# EAGLE design v1.0_r1 (EAGLE 9.6.2)
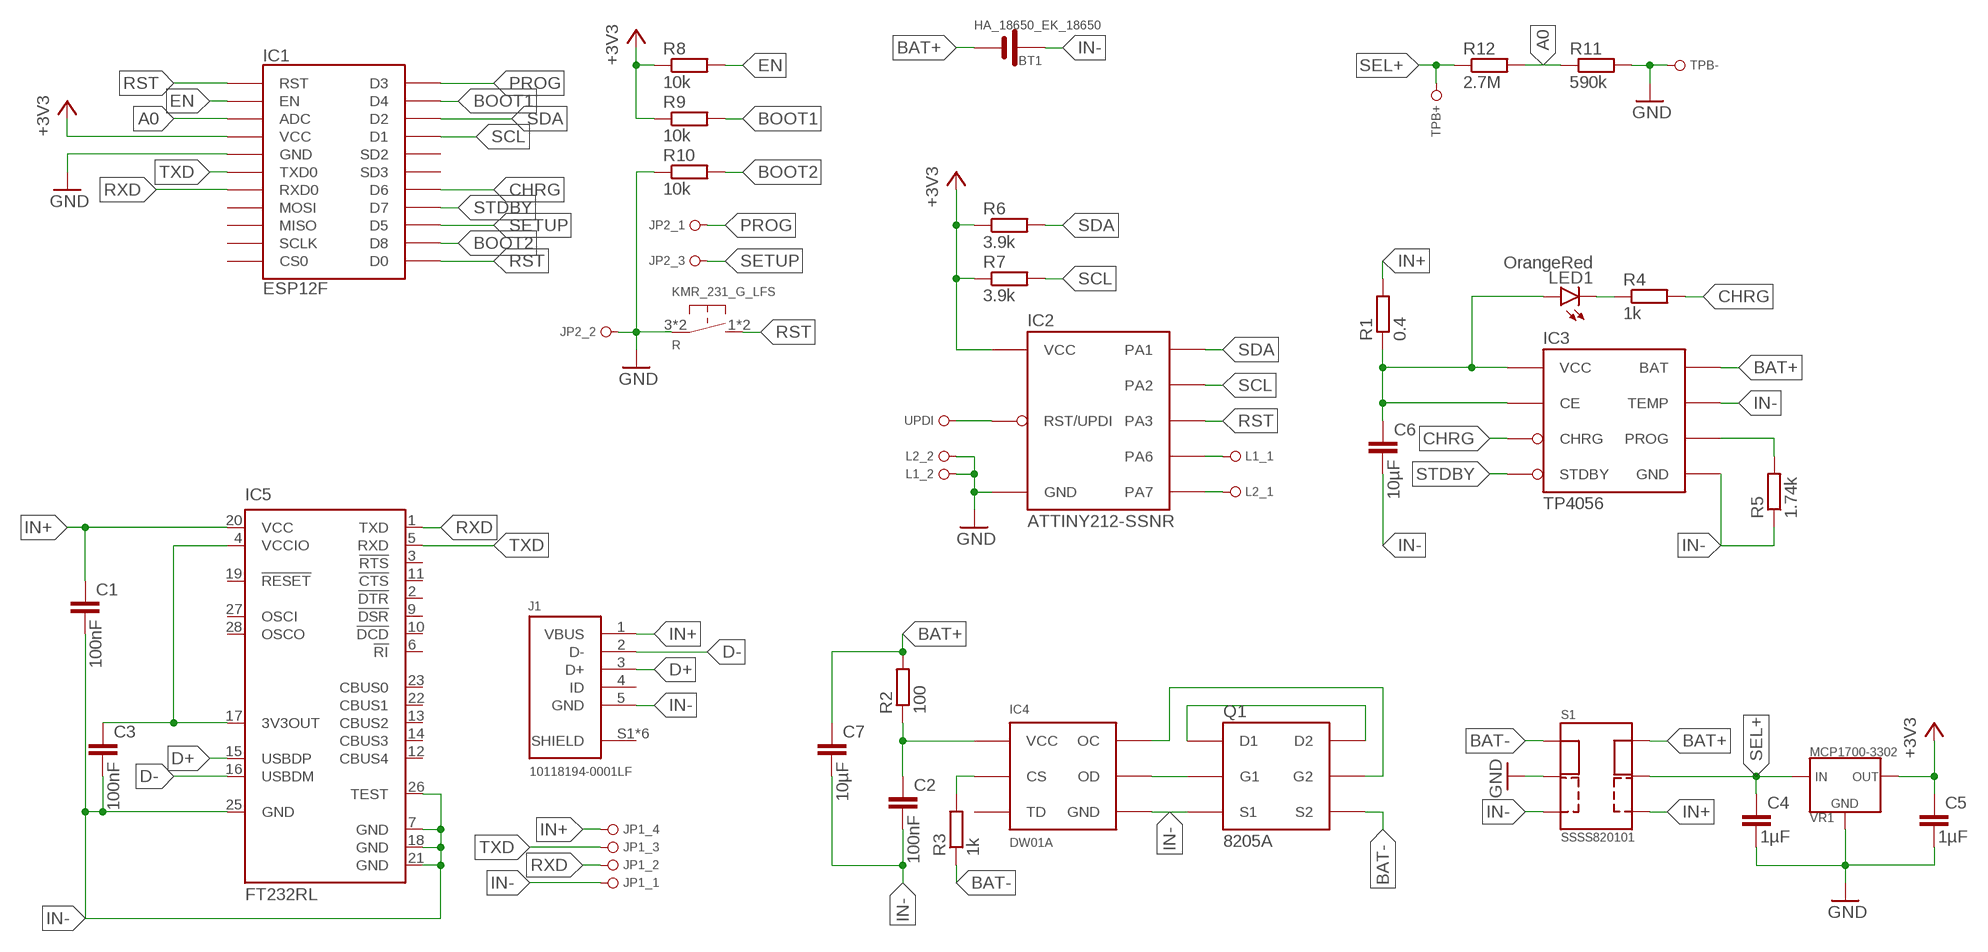
[diagram p0: schematic, sheet 1]

## Parts
BT1  HA_18650_EK_18650  [HA_18650_EK_18650]
C1  100nF  C-EUC0805  [C0805]
C2  100nF  C-EUC0805  [C0805]
C3  100nF  C-EUC0805  [C0805]
C4  1µF  C-EUC0805  [C0805]
C5  1µF  C-EUC0805  [C0805]
C6  10µF  C-EUC0805  [C0805]
C7  10µF  C-EUC0805  [C0805]
IC1  ESP12F  [ESP12]
IC2  ATTINY212-SSNR  [SOIC8]
IC3  TP4056  [SO8-THERMALPAD]
IC4  DW01A  [SOT23-6]
IC5  FT232RL  [SSOP28]
J1  10118194-0001LF  [10118194-0001LF]
JP1  PINHD_1X04_R_1  [1X04_R_1]
JP2  PINHD_1X03_R_1  [1X03_R_1]
L1  PINHD_1X02_R_1  [1X02_R_1]
L2  PINHD_1X02_R_1  [1X02_R_1]
LED1  OrangeRed  LEDCHIP-LED0805  [CHIP-LED0805]
Q1  8205A  [TSSOP8]
R  KMR_231_G_LFS  [KMR_231_G_LFS]
R1  0.4  R-EU_R0805  [R0805]
R2  100  R-EU_R0805  [R0805]
R3  1k  R-EU_R0805  [R0805]
R4  1k  R-EU_R0805  [R0805]
R5  1.74k  R-EU_R0805  [R0805]
R6  3.9k  R-EU_R0805  [R0805]
R7  3.9k  R-EU_R0805  [R0805]
R8  10k  R-EU_R0805  [R0805]
R9  10k  R-EU_R0805  [R0805]
R10  10k  R-EU_R0805  [R0805]
R11  590k  R-EU_R0805  [R0805]
R12  2.7M  R-EU_R0805  [R0805]
S1  SSSS820101  [SSSS820101]
TPB+  PINHD_1X01_S_0.8  [1X01_S_0.8]
TPB-  PINHD_1X01_S_0.8  [1X01_S_0.8]
UPDI  PINHD_1X01_S_0.8  [1X01_S_0.8]
VR1  MCP1700-3302  [SOT23]

## Nets
+3V3: C5.1 IC1.VCC IC2.1(VCC) R6.1 R7.1 R8.1 R9.1 VR1.2(OUT)
A0: IC1.ADC R11.1 R12.2
BAT+: BT1.P1(PLUS) BT1.P2(PLUS) BT1.P3(PLUS) C7.1 IC3.5(BAT) R2.2 S1.6
BAT-: Q1.6(S2) Q1.7(S2) R3.1 S1.3
BOOT1: IC1.GPIO2(D4) R9.2
BOOT2: IC1.GPIO15(D8) R10.2
CHRG: IC1.GPIO12(D6) IC3.7(CHRG) R4.2
D+: IC5.15(USBDP) J1.3(D+)
D-: IC5.16(USBDM) J1.2(D-)
EN: IC1.EN R8.2
GND: C4.2 C5.2 IC1.GND IC2.8(GND) JP2.2 L1.2 L2.2 R10.1 R11.2 R.3 R.4 S1.2 TPB-.1 VR1.1(GND)
IN+: C1.1 IC5.20(VCC) J1.1(VBUS) JP1.4 R1.2 S1.4
IN-: BT1.M1(MINUS) BT1.M2(MINUS) BT1.M3(MINUS) C1.2 C2.2 C3.2 C6.2 C7.2 IC3.1(TEMP) IC3.3(GND) IC3.T1(GND) IC3.T2(GND) IC3.T3(GND) IC3.T4(GND) IC3.T5(GND) IC3.T6(GND) IC3.T7(GND) IC3.T8(GND) IC4.6(GND) IC5.7(GND) IC5.18(GND) IC5.21(GND) IC5.25(GND) IC5.26(TEST) J1.5(GND) JP1.1 Q1.2(S1) Q1.3(S1) R5.1 S1.1
L1: IC2.2(PA6) L1.1
L2: IC2.3(PA7) L2.1
N$1: C6.1 IC3.4(VCC) IC3.8(CE) LED1.A R1.1
N$2: IC3.2(PROG) R5.2
N$3: IC4.2(CS) R3.2
N$4: C2.1 IC4.5(VCC) R2.1
N$7: LED1.C R4.1
N$8: IC4.1(OD) Q1.4(G1)
N$10: Q1.1(D1) Q1.8(D2)
N$11: IC4.3(OC) Q1.5(G2)
PROG: IC1.GPIO0(D3) JP2.1
RST: IC1.GPIO16(D0) IC1.RST IC2.7(PA3) R.1 R.2
RXD: IC1.RXD0 IC5.1(TXD) JP1.2
SCL: IC1.GPIO5(D1) IC2.5(PA2) R7.2
SDA: IC1.GPIO4(D2) IC2.4(PA1) R6.2
SEL+: C4.1 R12.1 S1.5 TPB+.1 VR1.3(IN)
SETUP: IC1.GPIO14(D5) JP2.3
STDBY: IC1.GPIO13(D7) IC3.6(STDBY)
TXD: IC1.TXD0 IC5.5(RXD) JP1.3
UPDI: IC2.6(RST/UPDI) UPDI.1
VCCIO: C3.1 IC5.4(VCCIO) IC5.17(3V3OUT)
Unconnected: IC1.CS0 IC1.GPIO9(SD2) IC1.GPIO10(SD3) IC1.MISO IC1.MOSI IC1.SCLK IC4.4(TD) IC5.2(!DTR) IC5.3(!RTS) IC5.6(!RI) IC5.9(!DSR) IC5.10(!DCD) IC5.11(!CTS) IC5.12(CBUS4) IC5.13(CBUS2) IC5.14(CBUS3) IC5.19(!RESET) IC5.22(CBUS1) IC5.23(CBUS0) IC5.27(OSCI) IC5.28(OSCO) J1.4(ID)

## Power pins joined to a net without a drawn wire
SHIELD: J1.S1(SHIELD) J1.S2(SHIELD) J1.S3(SHIELD) J1.S4(SHIELD) J1.S5(SHIELD) J1.S6(SHIELD)

## Library data of the parts
BT1 = no_reichelt:HA_18650_EK
C1-C7 = rcl:C-EU: CAPACITOR, European symbol; SPICEPREFIX: C
IC1 = no_expressif:ESP12
IC2 = no_microchip:ATTINY212
IC3 = no_reichelt:TP4056
IC4 = no_reichelt:DW01A
IC5 = ftdichip:FT232R: Source: http://www.ftdichip.com/Documents/DataSheets/DS_FT232R_v104.pdf; MPN: FT232RL; OC_FARNELL: 1146032; OC_NEWARK: 91K9918
J1 = no_reichelt:10118194-0001LF: CONN RCPT USB2.0 MICRO B SMD R/A Manufacturer's datasheet <https://www.amphenol-icc.com/media/wysiwyg/files/drawing/10118194.pdf?__cf_chl_jschl_tk__=1e9b4569481076e99900b246ea640525553a7b60-1588047333-0-AZhEk6D50lwOf6CdaXmV1teudqMKHMxqtb1pEtnUtu77sOc-OVRjbCmHdORomVnr0W49D2E8XkcMdJ2SdWt5rDDYIblyJz7fSv-zilM8vQKAQDC1Z9aMVORhnMgYjPDuz8XpfDLul_eaqqFpemo1xIgoZv50WTuLMwu26ci7e02s9PWvR3z1cDqm9GMGYIPwIUd9yh5-TtN_o6DbEkadC7zoJlhYZSw-VEaYzfWnBSFg_n44fbEB3slHLR2YKLSiTmh8RSwpxKUP4gER0KeVoie9w-Ibtx3oKQbsZjrsPLGSu9BzV2nf3QeoErALCQuycvY9WhQdebLIpxaon6SXufpVIIdoKZHRpjuVVlAkUIr9oSIZGQzzOWY1-dWY48jVEOvnvoxw9-xup5uFcr7XWo0>; CREATED_BY: PCBLayout.com; DIGIKEY_PARTNO: 609-4618-2-ND; MANUFACTURER: Amphenol ICC (FCI); MPN: 10118194-0001LF
JP1 = no_pinhd:PINHD_1X04; DRILL: 1mm; PADSHAPE: round
JP2 = no_pinhd:PINHD_1X03; DRILL: 1mm; PADSHAPE: round
L1 L2 = no_pinhd:PINHD_1X02; DRILL: 1mm; PADSHAPE: round
LED1 = led:LED: LED OSRAM: - CHIPLED LG R971, LG N971, LY N971, LG Q971, LY Q971, LO R971, LY R971 LH N974, LH R974 LS Q976, LO Q976, LY Q976 LO Q996 - Hyper CHIPLED LW Q18S LB Q993, LB Q99A, LB R99A - SideLED LS A670, LO A670, LY A670, LG A670, LP A670 LB A673, LV A673, LT A673, LW A673 LH A674 LY A675 LS A676, LA A676, LO A676, LY A676, LW A676 LS A679, LY A679, LG A679 - Hyper Micro SIDELED® LS Y876, LA Y876, LO Y876, LY Y876 LT Y87S - SmartLED LW L88C, LW L88S LB L89C, LB L89S, LG L890 LS L89K, LO L89K, LY L89K LS L896, LA L896, LO L896, LY L896 - TOPLED LS T670, LO T670, LY T670, LG T670, LP T670 LSG T670, LSP T670, LSY T670, LOP T670, LYG T670 LG T671, LOG T671, LSG T671 LB T673, LV T673, LT T673, LW T673 LH T674 LS T676, LA T676, LO T676, LY T676, LB T676, LH T676, LSB T676, LW T676 LB T67C, LV T67C, LT T67C, LS T67K, LO T67K, LY T67K, LW E67C LS E67B, LA E67B, LO E67B, LY E67B, LB E67C, LV E67C, LT E67C LW T67C LS T679, LY T679, LG T679 LS T770, LO T770, LY T770, LG T770, LP T770 LB T773, LV T773, LT T773, LW T773 LH T774 LS E675, LA E675, LY E675, LS T675 LS T776, LA T776, LO T776, LY T776, LB T776 LHGB T686 LT T68C, LB T68C - Hyper Mini TOPLED® LB M676 - Mini TOPLED Santana® LG M470 LS M47K, LO M47K, LY M47K Source: http://www.osram.convergy.de LUXEON: - LUMILED® LXK2-PW12-R00, LXK2-PW12-S00, LXK2-PW14-U00, LXK2-PW14-V00 LXK2-PM12-R00, LXK2-PM12-S00, LXK2-PM14-U00 LXK2-PE12-Q00, LXK2-PE12-R00, LXK2-PE12-S00, LXK2-PE14-T00, LXK2-PE14-U00 LXK2-PB12-K00, LXK2-PB12-L00, LXK2-PB12-M00, LXK2-PB14-N00, LXK2-PB14-P00, LXK2-PB14-Q00 LXK2-PR12-L00, LXK2-PR12-M00, LXK2-PR14-Q00, LXK2-PR14-R00 LXK2-PD12-Q00, LXK2-PD12-R00, LXK2-PD12-S00 LXK2-PH12-R00, LXK2-PH12-S00 LXK2-PL12-P00, LXK2-PL12-Q00, LXK2-PL12-R00 Source: www.luxeon.com KINGBRIGHT: KA-3528ASYC Source: www.kingbright.com
Q1 = no_reichelt:8205A
R = no_reichelt:KMR_231_G_LFS
R1-R12 = rcl:R-EU_: RESISTOR, European symbol; SPICEPREFIX: R
S1 = no_reichelt:SSSS820101
TPB+ TPB- UPDI = no_pinhd:PINHD_1X01; DRILL: 0.8mm; PADSHAPE: square
VR1 = no_reichelt:MCP170

## Board
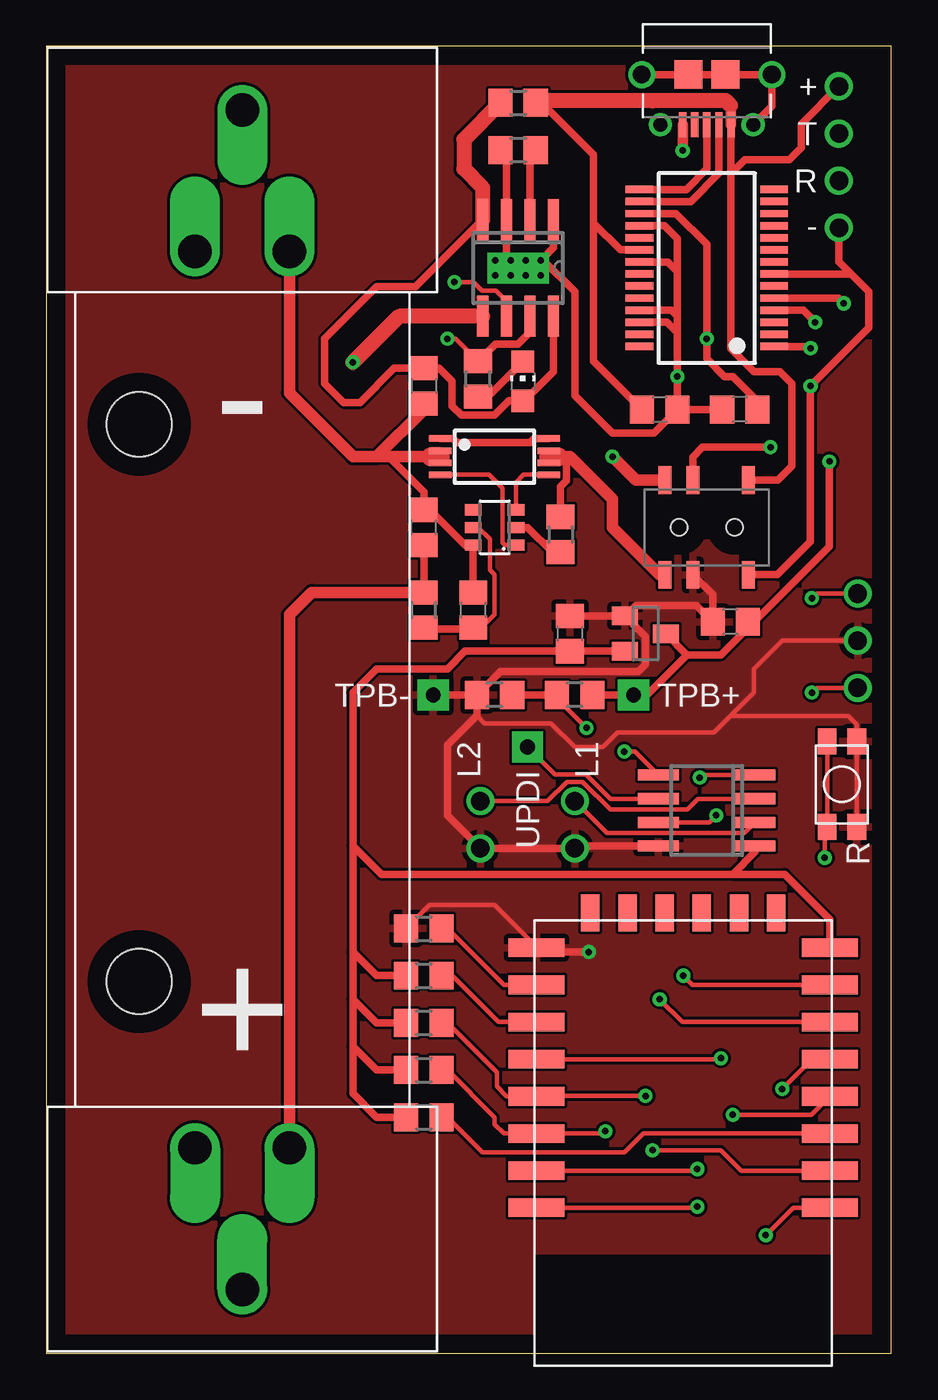
[diagram p1: board, top side]
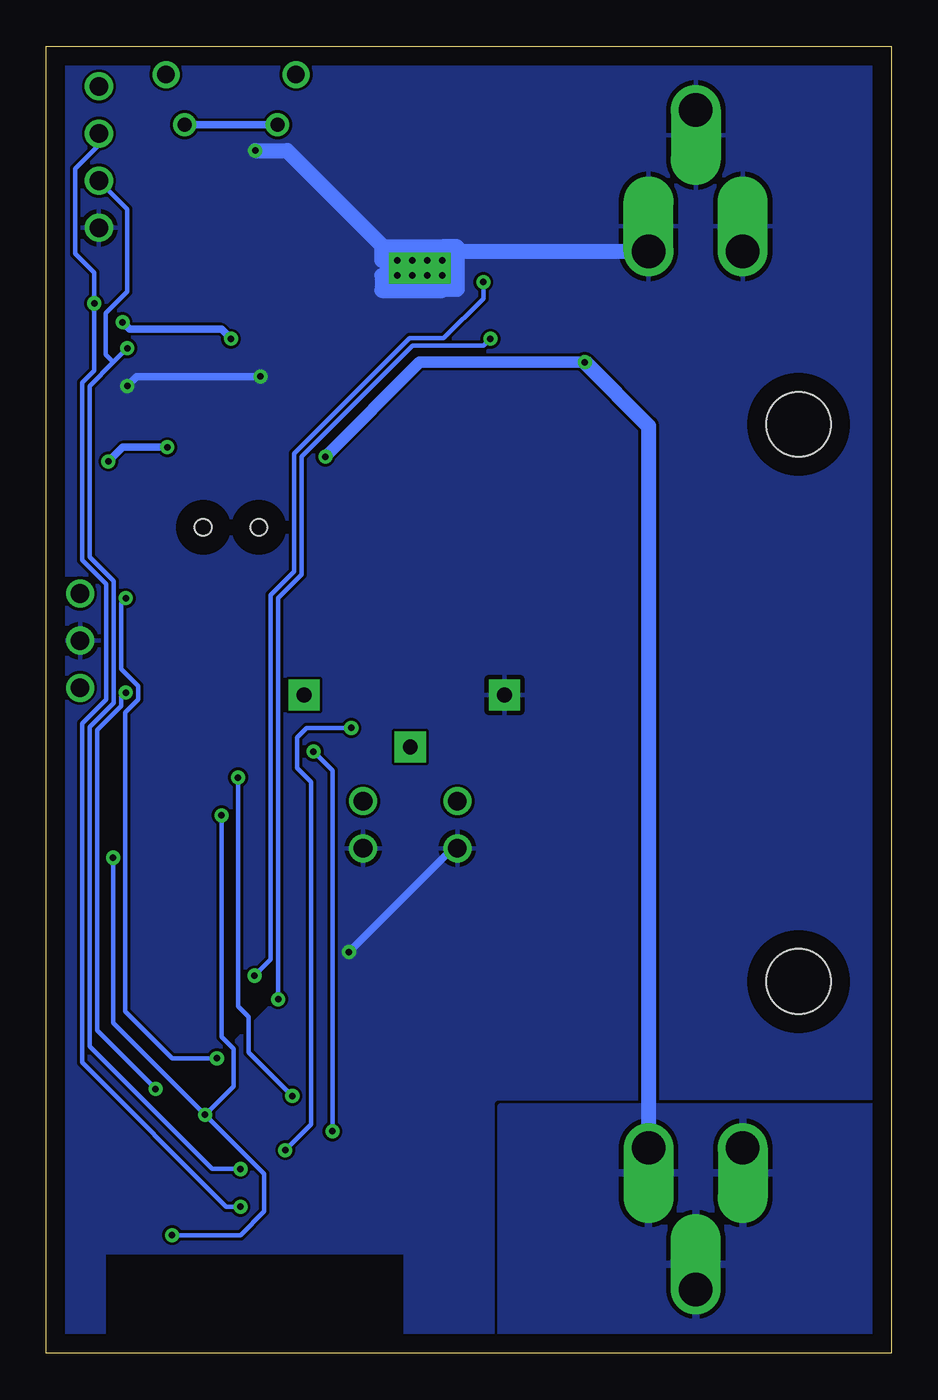
[diagram p2: board, bottom side, seen from below]

Size 45.5 x 70.35 mm. Coordinates in mm from the lower left corner, seen from the top.
Outline: 0,0 45.5,0 45.5,70.35 0,70.35 0,0
Copper layers (1*16): Top 0.035mm / dielectric 1.5mm / Bottom 0.035mm
Design rules "JLCPCB": minimum track width 6mil, minimum drill 0.3mm, track to track 6mil, track to pad 6mil, pad to pad 6mil, via to via 6mil, smd to smd 6mil, copper to edge 40mil, drill to drill 8mil, minimum pad ring 10mil, minimum via ring 8mil, stop-mask expansion 4mil, vias tented up to drill 0mil, thermal gap 10mil
Holes 3.5 mm at 5,20 5,50

### Footprints (pad centres in the part's own frame; a part is rotated, then mirrored left to right if it is on the bottom)
HA_18650_EK_18650 = drill 1.8 offset: M1 0,-30.48; M2 2.54,-22.86; M3 -2.54,-22.86; P1 0,33.02; P2 -2.54,25.4; P3 2.54,25.4
C0805 = smd 1.3 x 1.5: 1 -0.95,0; 2 0.95,0
ESP12 = smd 3 x 1: ADC -7.9,1.48; EN -7.9,-0.52; GND 7.9,-10.52; GPIO0 7.9,-4.52; GPIO2 7.9,-6.52; GPIO4 7.9,-2.52; GPIO5 7.9,-0.52; GPIO12 -7.9,-6.52; GPIO13 -7.9,-8.52; GPIO14 -7.9,-4.52; GPIO15 7.9,-8.52; GPIO16 -7.9,-2.52; RST -7.9,3.48; RXD0 7.9,1.48; TXD0 7.9,3.48; VCC -7.9,-10.52 | smd 1 x 2: CS0 -5,-12.4; GPIO9 -1,-12.4; GPIO10 1,-12.4; MISO -3,-12.4; MOSI 3,-12.4; SCLK 5,-12.4
SOIC8 = smd 0.6 x 2.2: 1 -1.905,-2.6; 2 -0.635,-2.6; 3 0.635,-2.6; 4 1.905,-2.6; 5 1.905,2.6; 6 0.635,2.6; 7 -0.635,2.6; 8 -1.905,2.6
SO8-THERMALPAD = smd 0.6 x 2.2: 1 -1.905,-2.6; 2 -0.635,-2.6; 3 0.635,-2.6; 4 1.905,-2.6; 5 1.905,2.6; 6 0.635,2.6; 7 -0.635,2.6; 8 -1.905,2.6 | drill 0.35 pad 0.813 square: T1 -1.219,0.406; T2 -0.406,0.406; T3 0.406,0.406; T4 1.219,0.406; T5 -1.219,-0.406; T6 -0.406,-0.406; T7 0.406,-0.406; T8 1.219,-0.406
SOT23-6 = smd 0.6 x 0.9: 1 -0.95,-1.15; 2 0,-1.15; 3 0.95,-1.15; 4 0.95,1.15; 5 0,1.15; 6 -0.95,1.15
SSOP28 = smd 0.4 x 1.5: 1 -4.225,-3.625; 2 -3.575,-3.625; 3 -2.925,-3.625; 4 -2.275,-3.625; 5 -1.625,-3.625; 6 -0.975,-3.625; 7 -0.325,-3.625; 8 0.325,-3.625; 9 0.975,-3.625; 10 1.625,-3.625; 11 2.275,-3.625; 12 2.925,-3.625; 13 3.575,-3.625; 14 4.225,-3.625; 15 4.225,3.625; 16 3.575,3.625; 17 2.925,3.625; 18 2.275,3.625; 19 1.625,3.625; 20 0.975,3.625; 21 0.325,3.625; 22 -0.325,3.625; 23 -0.975,3.625; 24 -1.625,3.625; 25 -2.275,3.625; 26 -2.925,3.625; 27 -3.575,3.625; 28 -4.225,3.625
10118194-0001LF = smd 0.4 x 1.35: 1 -1.3,2.7; 2 -0.65,2.7; 3 0,2.7; 4 0.65,2.7; 5 1.3,2.7 | drill 0.75: S1 -2.5,2.7; S2 2.5,2.7 | drill 0.95: S3 -3.5,0; S6 3.5,0 | smd 1.5 x 1.55: S4 -1,0; S5 1,0
1X04_R_1 = drill 1: 1 0,0; 2 2.54,0; 3 5.08,0; 4 7.62,0
1X03_R_1 = drill 1: 1 0,0; 2 2.54,0; 3 5.08,0
1X02_R_1 = drill 1: 1 0,0; 2 2.54,0
CHIP-LED0805 = smd 1.2 x 1.2: A 0,-1.05; C 0,1.05
TSSOP8 = smd 1.2 x 0.35: 1 -2.925,0.975; 2 -2.925,0.325; 3 -2.925,-0.325; 4 -2.925,-0.975; 5 2.925,-0.975; 6 2.925,-0.325; 7 2.925,0.325; 8 2.925,0.975
KMR_231_G_LFS = smd 1 x 1.4: 1 0,4.35; 2 0,-0.25; 3 1.6,-0.25; 4 1.6,4.35
R0805 = smd 1.3 x 1.5: 1 -0.95,0; 2 0.95,0
SSSS820101 = smd 1.5 x 0.7: 1 -2.55,-2.25; 2 -2.55,0.75; 3 -2.55,2.25; 4 2.55,-2.25; 5 2.55,0.75; 6 2.55,2.25 | hole 0.9: 0,1.5; 0,-1.5
1X01_S_0.8 = drill 0.8 pad 1.676 square: 1 0,0
SOT23 = smd 1 x 1.4: 1 -0.95,-1.1; 2 0.95,-1.1; 3 0,1.1

### Placement (x,y rotation side)
BT1  10.54,36.45 180 top
C1  33.02,50.8 0 top
C2  22.99,40.01 90 top
C3  37.34,50.8 180 top
C4  36.83,39.37 180 top
C5  28.19,38.73 90 top
C6  20.32,52.07 270 top
C7  20.32,44.45 90 top
IC1  34.29,11.3 180 top
IC2  35.56,29.21 90 top
IC3  25.4,58.42 180 top
IC4  24.13,44.45 90 top
IC5  35.56,58.42 90 top
J1  35.56,68.83 180 top
JP1  42.67,60.58 90 top
JP2  43.69,40.89 270 top
L1  28.45,29.72 270 top
L2  23.37,29.72 270 top
LED1  25.65,52.32 0 top
Q1  24.13,48.26 0 top
R  42.04,28.57 0 top
R1  25.4,67.31 0 top
R2  20.32,40.01 90 top
R3  27.69,44.07 270 top
R4  23.24,52.45 90 top
R5  25.4,64.77 0 top
R6  20.32,17.78 0 top
R7  20.32,15.24 0 top
R8  20.32,12.7 0 top
R9  20.32,20.32 0 top
R10  20.32,22.86 0 top
R11  24.13,35.43 180 top
R12  28.45,35.43 180 top
S1  35.56,44.45 90 top
TPB+  31.62,35.43 0 top
TPB-  20.83,35.43 0 top
UPDI  25.91,32.64 0 top
VR1  32.26,38.73 270 top

### Tracks (layer width: path | path; a pad name or v marks a point on that pad's centre or on a via)
+3V3
  Top 0.406: VR1.2 C5.1 22.55,37.78 21.59,36.83 17.78,36.83 16.51,35.56 16.51,27.3 | IC2.1 38.16,26.98 36.96,25.78 | 36.96,25.78 18.03,25.78 16.51,27.3 | 36.96,25.78 39.75,25.78 42.19,23.34 IC1.VCC | R8.1 17.78,12.7 16.51,13.97 16.51,16.51 | 16.51,27.3 16.51,21.59 | 16.51,21.59 16.51,19.05 | 16.51,19.05 16.51,16.51 | R7.1 17.78,15.24 16.51,16.51 | R6.1 17.78,17.78 16.51,19.05 | R9.1 17.78,20.32 16.51,21.59
A0  (via drill 0.35)
  Top 0.254: IC1.ADC 37.42,9.82 36.32,10.92 v32.64,10.92 | v29.08,33.66 27.5,35.24 R12.2
  Top 0.406: R11.1 R12.2
  Bottom 0.254: v32.64,10.92 31.24,12.32 31.24,30.73 32,31.5 32,33.15 31.5,33.66 v29.08,33.66
BAT+  (via drill 0.35)
  Top 0.406: C7.1 R2.2
  Top 0.61: BT1.P2 13.08,39.75 14.29,40.95 R2.2 | v30.48,48.26 31.74,47 S1.6
  Top 0.813: IC3.5 18.99,55.82 v16.51,53.34
  Bottom 0.61: v16.51,53.34 25.4,53.34 v30.48,48.26
  Bottom 0.813: v16.51,53.34 13.08,49.91 BT1.P2
  pour Bottom: 0,13.26 0,0 21.03,0 21.03,13.26
BAT-
  Top 0.203: Q1.7 27.05,48.26 Q1.6
  Top 0.406: R3.1 27.69,46.64 28.01,46.96 28.01,48.08 28.19,48.26
  Top 0.61: S1.3 33.03,41.9 30.48,44.45 30.48,45.97 28.19,48.26 27.56,48.26
  Top 1.016: 27.05,48.26 27.56,48.26
BOOT1
  Top 0.254: R9.2 21.84,20.32 24.34,17.82 IC1.GPIO2
BOOT2
  Top 0.254: R10.2 21.59,22.86 24.63,19.82 IC1.GPIO15
CHRG  (via drill 0.35)
  Top 0.254: v21.59,54.61 22.03,54.61 R4.2 | IC1.GPIO12 34.25,17.82 v33.02,19.05
  Top 0.406: IC3.7 26.04,54.97 25.4,54.33 24.17,54.33 R4.2
  Bottom 0.254: v21.59,54.61 21.97,54.23 25.78,54.23 31.75,48.26 31.75,41.91 33.02,40.64 v33.02,19.05
D+
  Top 0.406: J1.3 35.56,63.75 34.45,62.65 IC5.15
D-
  Top 0.406: J1.2 36.21,63.52 34.69,61.99 IC5.16
EN
  Top 0.254: R8.2 21.59,12.7 23.5,10.79 31.11,10.79 32.14,11.82 IC1.EN
GND  (via drill 0.35)
  Top 0.254: R10.1 20.64,24.13 24.13,24.13 26.39,21.87 IC1.GND | R.3 R.4 43.64,33.83 43.18,34.29 36.83,34.29 | JP2.2 39.62,38.35 38.1,36.83 38.1,35.56 36.83,34.29 | 36.83,34.29 35.94,33.4 30.73,33.4 29.97,32.64 28.45,32.64 27.18,33.91 23.6,33.91 23.18,34.33
  Top 0.406: S1.2 35.88,40.83 C4.2 34.99,40.26 31.75,40.26 31.18,39.69 VR1.1 | C5.2 VR1.1 | VR1.1 32.26,38.59 32.26,37.08 31.88,36.7 24.45,36.7 24.07,36.33 R11.2 | TPB-.1 R11.2 | R11.2 23.18,34.33 21.59,32.74 21.59,28.96 L2.2 L1.2 28.57,27.3 IC2.8 | v29.21,21.59 26.62,21.59 IC1.GND
  Bottom 0.406: L2.2 23.62,27.18 v29.21,21.59
  pour Top: 0,0 45.5,0 45.5,70.35 0,70.35
  pour Bottom (rank 2): 13.97,0 45.5,0 45.5,41.91 43.18,41.91 41.91,40.64 41.91,35.56 41.91,34.29 43.18,33.02 43.18,16.51 41.91,15.24 38.1,15.24 36.83,15.24 33.02,19.05 33.02,21.59 33.02,40.64 31.75,41.91 31.75,48.26 26.67,53.34 16.51,53.34 13.97,50.8 12.7,49.53 12.7,39.37 12.7,12.7 12.7,1.27
IN+
  Top 0.406: 29.46,60.83 29.46,64.52 26.67,67.31 R1.2 | 29.46,60.83 30.9,59.4 IC5.20 | 29.46,60.83 29.46,53.41 C1.1 | J1.1 36.86,63.5 | 36.86,63.5 36.86,54.07 38.1,52.83 39.5,52.83 40.13,52.2 40.13,47.75 39.38,47 S1.4 | JP1.4 40.64,66.17 40.64,64.9 40.01,64.26 37.62,64.26 36.86,63.5
  Top 0.559: J1.1 36.86,67.15 36.83,67.18
  Top 0.813: 36.83,67.18 36.58,67.44 32.67,67.44 32.65,67.41 26.45,67.41 R1.2
IN-  (via drill 0.35)
  Top 0.254: Q1.2 21.2,48.26 Q1.3
  Top 0.406: R5.1 24.77,64.45 IC3.3 24.77,59.05 IC3.T7 | 33.97,54.93 v33.97,52.58 C1.2 | IC5.26 33.41,55.49 33.97,54.93 | 33.97,55.82 33.97,54.93 | 33.97,55.82 33.64,56.15 IC5.25 | 33.97,55.82 33.97,58.23 | 33.97,58.23 33.45,58.74 IC5.21 | IC5.18 33.28,60.7 33.97,60.01 33.97,58.23 | C1.2 33.08,49.91 33.08,49.9 32.7,49.53 30.48,49.53 28.45,51.56 28.45,57.15 26.77,58.83 IC3.T5 | 17.78,48.26 18.41,48.26 20.32,46.35 C7.2 20.64,45.4 22.54,43.5 IC4.6 C2.2 | C3.2 C1.2 | S1.1 39.37,41.91 41.15,43.69 v41.15,52.07 44.28,55.2 44.28,57.15 43.34,58.09 | IC5.7 43.34,58.09 | IC3.T5 IC3.T6 IC3.T7 | IC3.T7 IC3.T8 IC3.T4 IC3.T3 IC3.T2 IC3.T1 | JP1.1 42.67,58.76 43.34,58.09 | IC3.1 27.3,59.51 IC3.T5
  Top 0.559: J1.5 v34.26,64.74
  Top 0.61: BT1.M3 13.08,51.69 16.51,48.26 17.78,48.26 | C6.2 20.32,50.8 17.78,48.26 | 20.7,48.26 17.78,48.26
  Top 1.016: 21.2,48.26 20.7,48.26
  Bottom 0.406: v33.97,52.58 40.64,52.58 v41.15,52.07
  Bottom 0.813: IC3.T3 24.99,57.21 | 24.99,57.21 24.18,57.21 IC3.T4 24.18,57.28 23.37,57.28 23.37,58.83 | IC3.T2 25.81,57.21 | 25.81,57.21 24.99,57.21 | IC3.T1 27.43,58.01 27.43,57.21 25.81,57.21 | IC3.T8 24.18,59.56 | 24.18,59.56 23.37,59.56 23.37,58.83 | IC3.T7 24.99,59.56 | 24.99,59.56 24.18,59.56 | IC3.T6 25.81,59.56 | 25.81,59.56 24.99,59.56 | 25.81,59.56 27.43,59.56 27.43,58.83 IC3.T5 32.53,64.74 v34.26,64.74 | IC3.T8 23.37,58.83 | IC3.T8 23.7,59.31 BT1.M3
  pour Bottom: 0,70.35 0,13.74 12.7,13.74 12.7,49.53 16.51,53.34 26.67,53.34 31.75,48.26 31.75,41.91 33.02,40.64 33.02,19.05 36.83,15.24 41.91,15.24 43.18,16.51 43.18,33.02 41.91,34.29 41.91,40.64 43.18,41.91 45.5,41.91 45.5,70.35
L1
  Top 0.254: L1.1 30.17,28 37.58,28 IC2.2
L2
  Top 0.254: L2.1 26.99,29.72 28.02,30.75 28.88,30.75 30.36,29.27 34.51,29.27 35.09,29.84 IC2.3
N$1
  Top 0.406: IC3.4 19.88,57.4 17.78,57.4 14.99,54.61 14.99,52.2 16,51.18 16.89,51.18 18.73,53.02 C6.1 21.15,53.02 21.84,52.32 21.84,50.99 22.34,50.49 24.14,50.49 24.92,51.27 LED1.A 25.75,51.27 27.3,52.83 IC3.8
  Top 0.813: R1.1 22.48,65.34 22.48,63.75 23.5,62.74 IC3.4
N$2
  Top 0.406: R5.2 26.04,64.45 IC3.2
N$3
  Top 0.406: IC4.2 25.91,44.45 27.24,43.12 R3.2
N$4
  Top 0.254: IC4.5 23.24,44.45 23.88,43.81 23.88,42.16 24.13,41.91 24.13,39.75 23.43,39.05 C2.1
  Top 0.406: R2.1 20.39,38.99 22.92,38.99 C2.1
N$7
  Top 0.406: R4.1 23.78,51.5 LED1.C
N$8
  Top 0.254: Q1.4 23.84,47.28 24.55,46.57 24.55,44.45 24.55,44.03 24.55,43.65 24.7,43.5 IC4.1
N$10
  Top 0.406: Q1.1 21.89,49.23 22.1,49.02 26.04,49.02 26.25,49.23 Q1.8
N$11
  Top 0.254: Q1.5 25.7,47.28 25.28,46.87 IC4.3
PROG  (via drill 0.35)
  Top 0.254: v41.23,40.64 41.48,40.89 JP2.1 | IC1.GPIO0 36.27,15.82 v36.32,15.88
  Bottom 0.254: v41.23,40.64 41.48,40.39 41.48,36.83 40.57,35.92 40.57,35.18 41.25,34.49 41.25,18.39 38.73,15.88 v36.32,15.88
RST  (via drill 0.35)
  Top 0.254: v38.73,6.35 40.21,7.82 IC1.RST | v41.91,26.67 41.91,28.2 R.2 R.1 | IC1.GPIO16 41.19,12.83 v36.96,12.83 | IC2.7 35.69,28.57 v36.07,28.96
  Bottom 0.254: v41.91,26.67 41.91,17.78 v36.96,12.83 | v38.73,6.35 35.05,6.35 33.78,7.62 33.78,9.65 v36.96,12.83 | v36.07,28.96 36.07,17.02 35.43,16.38 35.43,14.35 v36.96,12.83
RXD  (via drill 0.35)
  Top 0.254: IC1.RXD0 34.97,9.82 v35.05,9.91
  Top 0.406: IC5.1 41.05,54.2 v41.15,54.1
  Bottom 0.254: v41.15,54.1 41.91,53.34 | 41.91,53.34 43.18,52.07 43.18,42.87 41.88,41.57 41.88,35.01 43.18,33.72 43.18,16.51 36.58,9.91 v35.05,9.91 | JP1.2 41.15,61.59 41.15,57.15 42.31,55.98 42.31,53.74 41.91,53.34
SCL  (via drill 0.35)
  Top 0.254: v30.1,11.94 29.98,11.82 IC1.GPIO5 24.63,11.82 24.13,12.32 24.13,12.7 21.59,15.24 R7.2 | v31.11,32.38 31.69,32.38 IC2.5
  Bottom 0.254: v30.1,11.94 30.1,31.37 v31.11,32.38
SDA  (via drill 0.35)
  Top 0.254: v32.26,13.84 26.41,13.84 IC1.GPIO4 24.79,13.82 24.26,14.35 24.26,15.11 21.59,17.78 R6.2 | IC2.4 35.31,31.11 v35.18,30.99
  Bottom 0.254: v32.26,13.84 34.61,16.19 34.61,18.1 35.18,18.67 v35.18,30.99
SEL+  (via drill 0.35)
  Top 0.406: S1.5 34.81,48.25 35.33,48.77 v38.99,48.77 | 38.1,39.37 42.16,43.43 v42.16,48.01 | 38.1,39.37 C4.1 | VR1.3 34.5,37.59 | 38.1,39.37 36.32,37.59 34.5,37.59 | R12.1 TPB+.1 32.34,35.43 34.5,37.59
  Bottom 0.406: v38.99,48.77 41.4,48.77 v42.16,48.01
SETUP  (via drill 0.35)
  Top 0.254: v41.23,35.56 41.48,35.81 JP2.3 | IC1.GPIO14 41.22,15.82 v39.62,14.22
  Bottom 0.254: v41.23,35.56 41.48,35.31 41.48,34.84 42.77,33.55 42.77,17.37 v39.62,14.22
SHIELD
  Top 0.406: J1.S6 J1.S5 J1.S4 J1.S3 39.06,67.13 J1.S1
  Bottom 0.406: J1.S1 J1.S2
STDBY  (via drill 0.35)
  Top 0.254: v21.97,57.66 22.99,57.66 23.45,57.2 24.21,57.2 24.77,56.64 IC3.6 | IC1.GPIO13 34.79,19.82 v34.29,20.32
  Bottom 0.254: v21.97,57.66 21.97,56.77 24.11,54.63 25.95,54.63 32.16,48.43 32.16,42.08 33.43,40.81 33.43,21.18 v34.29,20.32
TXD  (via drill 0.35)
  Top 0.254: IC1.TXD0 35,7.82 v35.05,7.87
  Top 0.406: IC5.5 42.65,56.8 v42.93,56.52
  Bottom 0.254: JP1.3 42.67,65.02 43.94,63.75 43.94,59.18 42.93,58.17 v42.93,56.52 42.93,52.9 43.59,52.24 43.59,42.7 42.29,41.4 42.29,35.18 43.59,33.88 43.59,15.65 35.81,7.87 v35.05,7.87
UPDI
  Top 0.254: IC2.6 30.36,29.84 29.04,31.16 27.39,31.16 UPDI.1
VCCIO  (via drill 0.35)
  Top 0.406: IC5.17 33.91,61.34 35.56,59.69 v35.56,54.61 35.56,53.53 36.51,52.58 36.96,52.58 38.29,51.25 C3.1 | v41.4,55.5 40.76,56.15 IC5.4
  Bottom 0.406: v35.56,54.61 36.07,55.12 41.02,55.12 v41.4,55.5

### Text on the board
tNames: + | T | R | -
tDocu: by NiJO's | BAT | USB | P | S | NAHS-LatchBrick | v1.0 R1
bDocu: by NiJO's | NAHS-LatchBrick | v1.0 R1